# EAGLE design espduino-01 (EAGLE 7.2.0)
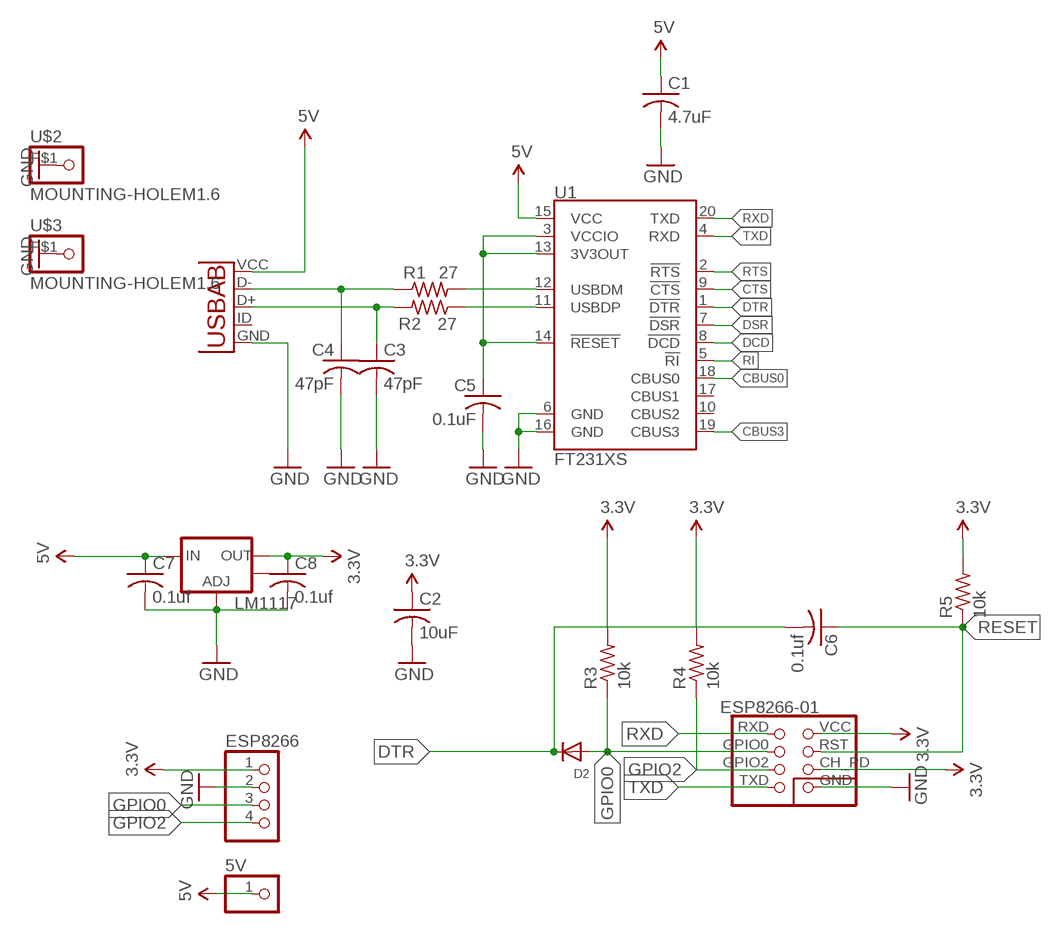
[diagram p0: schematic, sheet 1]

## Parts
5V  PINHD-1X1  [1X01]
C1  4.7uF  C-USC0603  [C0603]
C2  10uF  C-USC0603  [C0603]
C3  47pF  C-USC0603  [C0603]
C4  47pF  C-USC0603  [C0603]
C5  0.1uF  C-USC0603  [C0603]
C6  0.1uf  C-USC0603  [C0603]
C7  0.1uf  C-USC0603  [C0603]
C8  0.1uf  C-USC0603  [C0603]
D2  DIODESOT23_REFLOW  [SOT23-R]
ESP8266  PINHD-1X4  [1X04]
ESP8266-01  ESP8266ESP8266-01-MIN  [ESP8266-01-MIN]
LM1117  V_REG_LM1117SOT223  [SOT223]
R1  27  R-US_R0603  [R0603]
R2  27  R-US_R0603  [R0603]
R3  10k  R-US_R0603  [R0603]
R4  10k  R-US_R0603  [R0603]
R5  10k  R-US_R0603  [R0603]
U1  FT231XS  [SSOP20_L]
U2  USB-AB  [MICRO-USB-A01SB141B1]
U$2  MOUNTING-HOLEM1.6  [M1_6MOUNTING_HOLE]
U$3  MOUNTING-HOLEM1.6  [M1_6MOUNTING_HOLE]

## Nets
3.3V [POWER]: C2.1 C8.1 ESP8266-01.CH_PD ESP8266-01.VCC ESP8266.1 LM1117.2(OUT) R3.2 R4.2 R5.2
5V [POWER]: 5V.1 C1.1 C7.1 LM1117.3(IN) U1.15(VCC) U2.VCC(VBUS)
CBUS0: U1.18(CBUS0)
CBUS3: U1.19(CBUS3)
CTS: U1.9(!CTS)
DCD: U1.8(!DCD)
DSR: U1.7(!DSR)
DTR: C6.2 D2.3(C) U1.1(!DTR)
GND [POWER]: C1.2 C2.2 C3.2 C4.2 C5.2 C7.2 C8.2 ESP8266-01.GND ESP8266.2 LM1117.1(ADJ) U1.6(GND) U1.16(GND) U2.GND U$2.P$1(GND) U$3.P$1(GND)
GPIO0: D2.1(A) ESP8266-01.GPIO0 ESP8266.3 R3.1
GPIO2: ESP8266-01.GPIO2 ESP8266.4 R4.1
N$1: R1.2 U1.12(USBDM)
N$2: R2.1 U1.11(USBDP)
N$3: C3.1 R2.2 U2.D+
N$4: C4.1 R1.1 U2.D-
N$5 [POWER]: C5.1 U1.3(VCCIO) U1.13(3V3OUT) U1.14(!RESET)
RESET: C6.1 ESP8266-01.RST R5.1
RI: U1.5(!RI)
RTS: U1.2(!RTS)
RXD: ESP8266-01.RXD U1.20(TXD)
TXD: ESP8266-01.TXD U1.4(RXD)
Unconnected: LM1117.4(OUT) U1.10(CBUS2) U1.17(CBUS1) U2.ID(USBID)

## Library data of the parts
5V = pinhead:PINHD-1X1: PIN HEADER
C1-C8 = resistor:C-US: CAPACITOR, American symbol
D2 = adafruit:DIODE: Diode SMADIODE - SMA Surface Mount Package 20V 1A Schottky Diode Digikey: 641-1014-6-ND DO-1N4148 - Through Hole Small Current Diode SOD-123 20V 1 A (.5mV Vf) Schottky Diode - Digikey: MBRX120TPMSCT-ND SOD-323 10V 570mA (.38mV Vf, 3ns) Schottky Diode - Digikey: ZLLS410CT-ND SOD-523 30V 30mA Schottky Diode (RB751S-40TE61) - Digikey: RB751S-40TE61CT-ND SOT23-R/W - SOT23 Package (R = Solder Paste/Reflow Ovens, W = Hand-Soldering) BAT54Film 40V 300mA - Digikey: 497-7162-1-ND
ESP8266 = pinhead:PINHD-1X4: PIN HEADER
ESP8266-01 = jumper-parts:ESP8266
LM1117 = SparkFun-PowerIC:V_REG_LM1117: Voltage Regulator LM1117 Standard adjustable voltage regulator but in SMD form. Spark Fun Electronics SKU : COM-00595; PROD_ID: VREG-08170
R1-R5 = resistor:R-US_: RESISTOR, American symbol
U1 = SparkFun-DigitalIC:FT231X: FTDI FT231X Full Speed USB to Full-handshake UART This USB2.0 Full Speed IC offers a compact bridge to full handshake UART interfaces. The device is a UART, capable of operating up to 3MBaud, with low power consumption (8mA). The FT231X includes the complete FT-X series feature set and enables USB to be added into a system design quickly and easily over a UART interface.
U2 = jumper-parts:USB-AB: This is a USB AB connector that is compatible with USB OTG. i.e. this connector can serve as a host or device
U$2 U$3 = jumper-parts:MOUNTING-HOLE

## Net classes
0 default: width 0.254 mm
1 POWER: width 0.406 mm

## Board
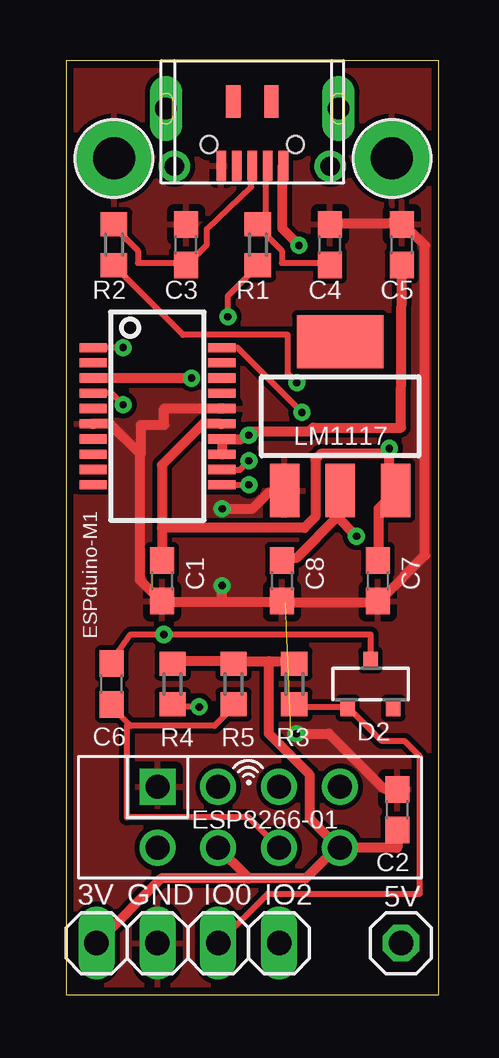
[diagram p1: board, top side]
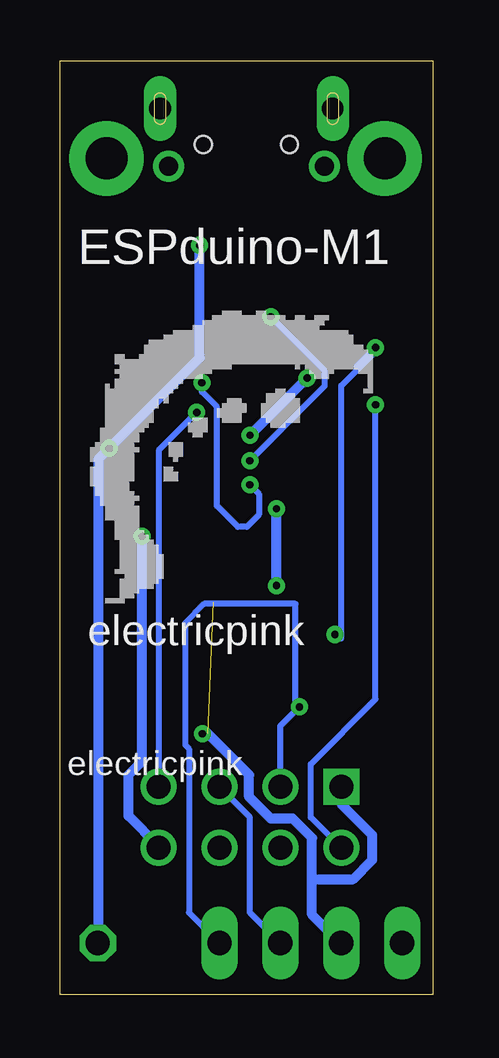
[diagram p2: board, bottom side, seen from below]

Size 15.54 x 38.91 mm. Coordinates in mm from the lower left corner, seen from the top.
Outline: 0,0 15.54,0 15.54,38.91 0,38.91 0,0
Copper layers (1*16): Top 0.035mm / dielectric 1.5mm / Bottom 0.035mm
Design rules "SeeedStudio_2layer_DRU_no_angle_20140221 *": minimum track width 8mil, minimum drill 12mil, track to track 8mil, track to pad 8mil, pad to pad 8mil, via to via 8mil, smd to smd 0mil, copper to edge 12mil, drill to drill 12mil, minimum pad ring 0mil, minimum via ring 8mil, stop-mask expansion 2mil, vias tented up to drill 100mil, thermal gap 12mil

### Footprints (pad centres in the part's own frame; a part is rotated, then mirrored left to right if it is on the bottom)
1X01 = drill 1.016 octagon: 1 0,0
C0603 = smd 1.1 x 1: 1 -0.85,0; 2 0.85,0
SOT23-R = smd 0.6 x 0.7: 1 -0.95,-1; 2 0.95,-1; 3 0,1
1X04 = drill 1.016 long: 1 -3.81,0; 2 -1.27,0; 3 1.27,0; 4 3.81,0
ESP8266-01-MIN = drill 1: CH_PD -1.27,-1.27; GPIO0 1.27,1.27; GPIO2 -1.27,1.27; RST 1.27,-1.27; RXD 3.81,1.27; TXD -3.81,-1.27; VCC 3.81,-1.27 | drill 1 square: GND -3.81,1.27
SOT223 = smd 1.219 x 2.235: 1 -2.311,-3.099; 2 0,-3.099; 3 2.311,-3.099 | smd 3.6 x 2.2: 4 0,3.099
R0603 = smd 1 x 1.1: 1 -0.85,0; 2 0.85,0
SSOP20_L = smd 0.381 x 1.143: 1 -2.857,-2.68; 2 -2.223,-2.68; 3 -1.587,-2.68; 4 -0.953,-2.68; 5 -0.318,-2.68; 6 0.318,-2.68; 7 0.953,-2.68; 8 1.587,-2.68; 9 2.223,-2.68; 10 2.857,-2.68; 11 2.857,2.68; 12 2.223,2.68; 13 1.587,2.68; 14 0.953,2.68; 15 0.318,2.68; 16 -0.318,2.68; 17 -0.953,2.68; 18 -1.587,2.68; 19 -2.223,2.68; 20 -2.857,2.68
MICRO-USB-A01SB141B1 = smd 0.4 x 1.25: D+ 0,-4.375; D- 0.65,-4.375; GND -1.3,-4.375; ID -0.65,-4.375; VCC 1.3,-4.375 | smd 0.6 x 1.35: P$1 -0.8,-1.7; P$2 0.8,-1.7 | drill 0.8 pad 1.3: P$8 -3.25,-4.4; P$9 3.25,-4.4 | drill 0.9 pad 1.1 long: P$10 -3.6,-2; P$12 3.6,-2 | hole 0.7: -1.8,-3.5; 1.8,-3.5
M1_6MOUNTING_HOLE = drill 1.75 pad 3.1: P$1 0,0

### Placement (x,y rotation side)
5V  13.97,2.16 0 top
C1  4,17.25 270 top
C2  13.81,7.71 90 top
C3  5,31.25 90 top
C4  11,31.25 90 top
C5  14,31.25 90 top
C6  1.91,12.95 90 top
C7  13,17.25 270 top
C8  9,17.25 270 top
D2  12.7,12.95 0 top
ESP8266  5.08,2.16 0 top
ESP8266-01  7.62,7.39 0 top
LM1117  11.43,24.11 0 top
R1  8,31.25 270 top
R2  2,31.25 90 top
R3  9.53,12.95 90 top
R4  4.45,12.95 90 top
R5  6.99,12.95 90 top
U1  3.81,24.11 270 top
U2  7.77,38.92 0 top
U$1  [JUMPER-LOGO-X-SMALL]  9.5,24.75 0 top
U$2  2,34.85 0 top
U$3  13.6,34.85 0 top

### Tracks (layer width: path | path; a pad name or v marks a point on that pad's centre or on a via)
3.3V  (via drill 0.3)
  Top 0.406: C2.1 13.81,6.12 ESP8266-01.VCC | R4.2 4.45,13.9 6.99,13.9 R5.2 7.14,13.9 8.46,13.9 | 8.46,13.9 9.53,13.9 R3.2 | 7.54,4.93 7.62,4.85 10,4.85 11.27,6.12 ESP8266-01.VCC | 7.54,4.93 ESP8266-01.CH_PD | ESP8266.1 3.97,4.85 7.46,4.85 7.54,4.93 | 9.03,18.08 C8.1 9.14,18.2 9.6,18.2 11.32,19.91 | 11.32,19.91 11.43,20.02 LM1117.2 | 8.46,13.9 8.46,10.88 10.17,9.16 10.17,7.34 11.2,6.31 ESP8266-01.VCC | v12.12,19.11 11.32,19.91
  Bottom 0.406: v12.12,19.11 12.12,9.74 12.69,9.16 12.69,7.45 11.43,6.19 ESP8266-01.VCC
5V  (via drill 0.3)
  Top 0.406: 4,19.45 4,22.08 5.71,23.8 6.4,23.8 U1.15 | 4,19.45 4,18.2 C1.1 | 13.03,18.08 C7.1 13.03,18.31 13.03,20.25 13.72,20.94 LM1117.3 13.6,21.17 13.49,21.28 v13.49,22.77 13.37,22.54 10.63,22.54 10.4,22.31 10.4,19.91 9.94,19.45 4,19.45 | v9.72,31.23 9.03,31.91 9.03,34.54 U2.VCC
  Bottom 0.406: v9.72,31.23 9.72,26.54 v13.49,22.77 13.95,22.31 13.95,2.19 5V.1
DTR  (via drill 0.3)
  Top 0.254: D2.3 12.7,15.01 v4.08,15.01 2.7,15.01 1.91,13.9 C6.2 | v2.38,26.97 U1.1
  Bottom 0.254: 3.17,26.17 v2.38,26.97 2.54,26.65 3.81,25.38 3.81,14.86 4.08,14.86 v4.08,15.01
GND  (via drill 0.3)  (1 unrouted)
  Top 0.406: 13.81,32.25 C5.2 | C4.2 11,32.12 13.62,32.12 13.62,32.25 C5.2 | v9.6,10.88 10.97,10.88 13.26,8.59 13.72,8.59 C2.2 | 6.51,16.37 8.91,16.37 C8.2 9.14,16.37 12.92,16.37 C7.2 13.14,16.48 14.97,18.31 14.97,31.23 14.17,32.02 C5.2 | 6.51,16.37 4,16.37 C1.2 3.89,16.48 3.09,17.28 3.09,22.54 | 3.09,22.54 1.83,23.8 1.14,23.8 U1.6 | v6.51,20.25 7.77,20.25 8.46,20.94 9.03,20.94 LM1117.1 | 6.51,16.37 v6.51,17.05 | 3.09,22.54 3.13,22.54 3.13,23.75 4.1,23.75 4.1,24.43 U1.16
  Bottom 0.406: v9.6,10.88 9.37,10.88 7.66,9.16 7.66,8.25 6.74,7.34 5.83,7.34 5.03,6.54 5.03,4.82 | 5.03,4.82 5.03,3.34 3.89,2.19 ESP8266.2 | 5.03,4.82 3.31,4.82 2.52,5.62 2.52,6.65 3.77,7.91 3.77,8.59 ESP8266-01.GND | v6.51,17.05 v6.51,20.25
  pour Top: 0,39 16,39 16,0 0,0
GPIO0
  Top 0.254: R3.1 9.53,12 11.75,12 D2.1 11.91,11.84 13.18,10.57 14.13,10.57 14.76,9.93 14.76,4.22 8.41,4.22 ESP8266.3
  Bottom 0.254: ESP8266-01.GPIO0 7.62,7.39 7.62,3.42 ESP8266.3
GPIO2  (via drill 0.3)
  Top 0.254: v5.56,12 4.45,12 R4.1
  Bottom 0.254: ESP8266-01.GPIO2 6.35,11.2 v5.56,12 5.71,12 5.71,16.28 9.53,16.28 10.32,15.49 10.32,10.41 10.16,10.25 10.16,3.42 ESP8266.4
N$1  (via drill 0.3)
  Top 0.254: v6.75,28.25 6.75,29.12 8,30.38 R1.2 | v7.62,22.25 7.25,21.88 6.5,21.88 U1.12
  Bottom 0.254: v6.75,28.25 4.5,26 4.5,25.38 v7.62,22.25
N$2  (via drill 0.3)
  Top 0.254: v9.62,25.5 9.25,25.88 9.25,27.5 4.88,27.5 2,30.38 R2.1 | v7.62,21.25 U1.11
  Bottom 0.254: v9.62,25.5 9.62,25.12 9,24.5 9,20.38 8.12,19.5 7.75,19.5 7.25,20 7.25,20.88 v7.62,21.25
N$3
  Top 0.254: R2.2 2,32 3,31 3,30.5 5,30.5 C3.1 5.12,30.5 5.88,31.25 5.88,31.9 7.72,33.65 7.72,34.75 U2.D+
N$4
  Top 0.254: C4.1 11,30.5 9,30.5 9,31 8,32 R1.1 8.35,31.88 8.35,34.75 U2.D-
N$5  (via drill 0.3)
  Top 0.406: C5.1 13.97,23.63 10.32,23.63 10.16,23.48 7.62,23.48 | 7.62,23.48 7.3,23.16 U1.14 6.51,23 6.51,22.52 U1.13 | v5.24,25.7 U1.3 | v7.62,23.32 7.62,23.48
  Bottom 0.406: v7.62,23.32 v5.24,25.7
RESET
  Top 0.254: 2.62,11.28 2.7,11.2 6.19,11.2 6.99,12 R5.1 | 2.62,11.28 1.91,12 C6.1 | ESP8266-01.RST 7.62,7.39 2.54,7.39 2.54,11.2 2.62,11.28
RXD  (via drill 0.3)
  Top 0.254: U1.20 7.14,26.97 v9.84,24.27
  Bottom 0.254: v9.84,24.27 11.43,22.68 ESP8266-01.RXD
TXD  (via drill 0.3)
  Top 0.254: U1.4 1.91,25.06 v2.38,24.59
  Bottom 0.254: v2.38,24.59 2.38,12.31 5.08,9.62 5.08,7.39 ESP8266-01.TXD

### Text on the board
tNames: ESPduino-M1 | 3V | GND | IO0 | IO2
bNames: ESPduino-M1 | electricpink